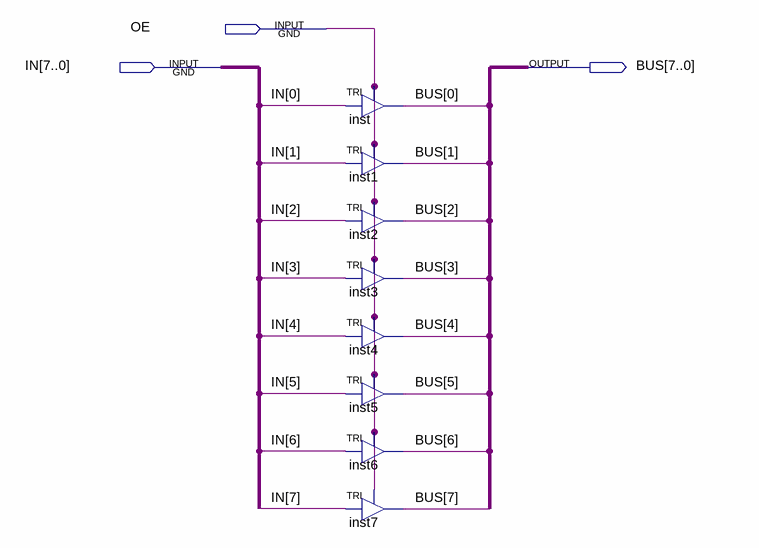
[diagram p0: schematic sheet]
// Quartus schematic tristate8bit.bdf as structural Verilog: 8 symbols, 3 pins
module tristate8bit (
  input  OE,
  input  [7:0] IN,
  output [7:0] BUS
);

  TRI inst (.IN(IN[0]), .OE(OE), .OUT(BUS[0]));
  TRI inst1 (.IN(IN[1]), .OE(OE), .OUT(BUS[1]));
  TRI inst2 (.IN(IN[2]), .OE(OE), .OUT(BUS[2]));
  TRI inst3 (.IN(IN[3]), .OE(OE), .OUT(BUS[3]));
  TRI inst4 (.IN(IN[4]), .OE(OE), .OUT(BUS[4]));
  TRI inst5 (.IN(IN[5]), .OE(OE), .OUT(BUS[5]));
  TRI inst6 (.IN(IN[6]), .OE(OE), .OUT(BUS[6]));
  TRI inst7 (.IN(IN[7]), .OE(OE), .OUT(BUS[7]));
endmodule
